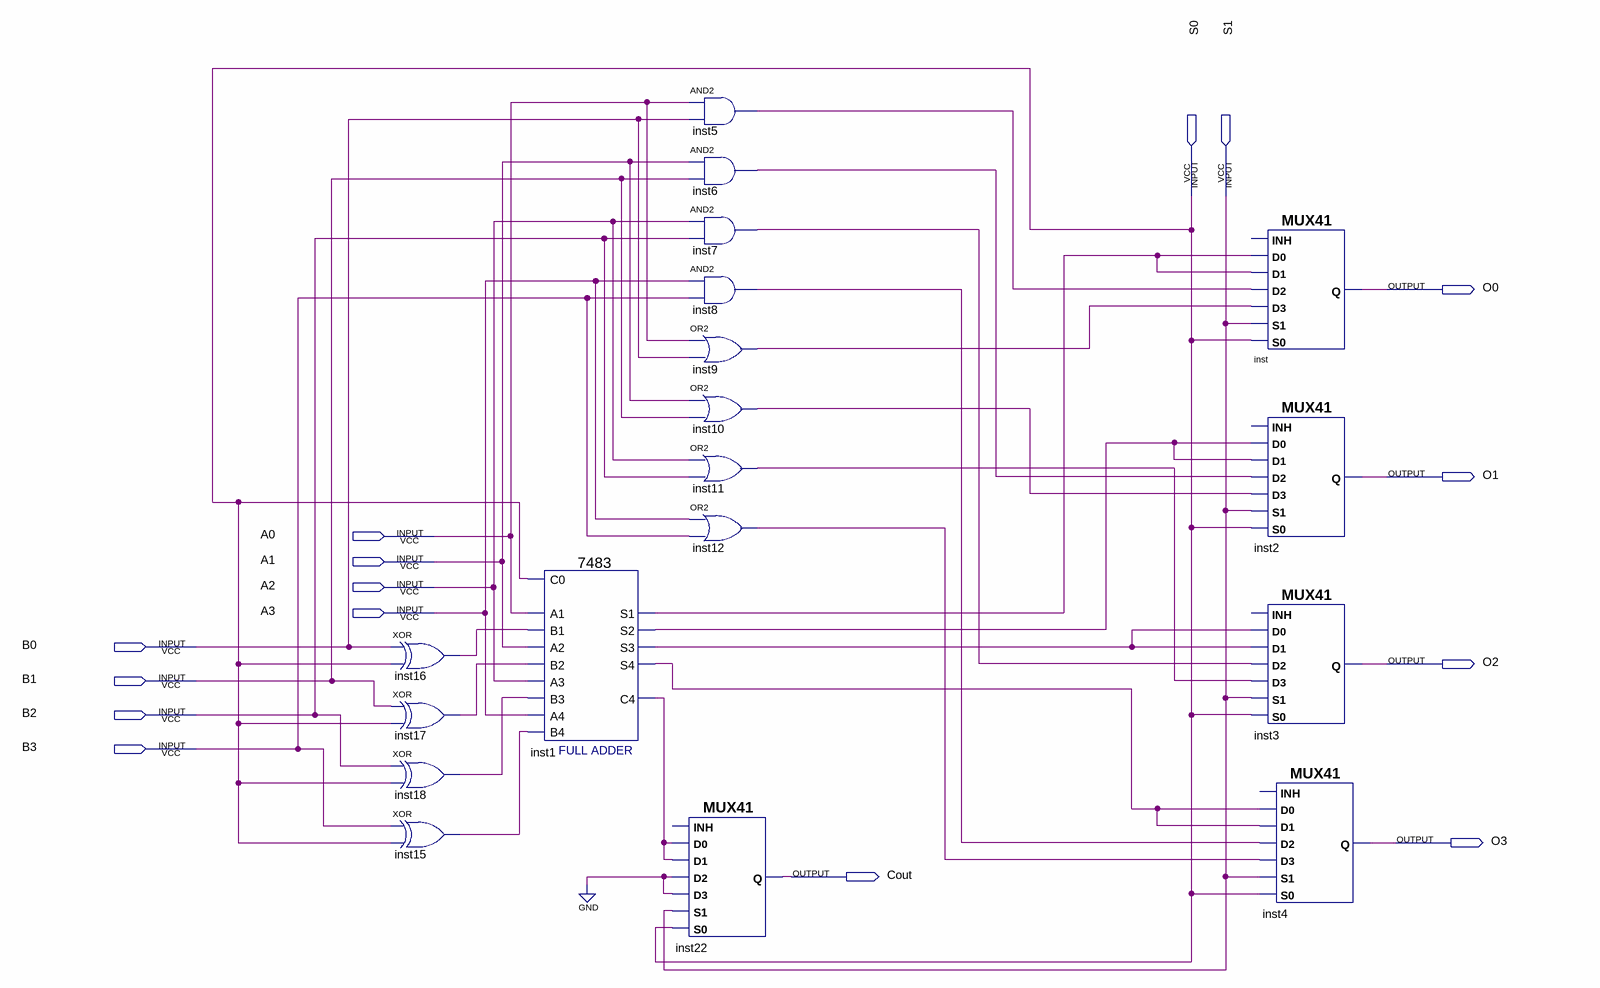
[diagram p0: schematic sheet]
// Quartus schematic lizur.bdf as structural Verilog: 18 symbols, 15 pins
module lizur (
  input  S0,
  input  S1,
  input  A0,
  input  A1,
  input  A2,
  input  A3,
  input  B0,
  input  B1,
  input  B2,
  input  B3,
  output O0,
  output O1,
  output O2,
  output O3,
  output Cout
);

  wire inst1_c4, inst1_s1, inst1_s2, inst1_s3, inst1_s4, inst5_out, inst6_out, inst7_out, inst8_out,
       inst9_out, inst10_out, inst11_out, inst12_out, inst15_out, inst16_out, inst17_out, inst18_out;

  xor inst16 (inst16_out, B0, S0);
  xor inst17 (inst17_out, B1, S0);
  xor inst18 (inst18_out, B2, S0);
  xor inst15 (inst15_out, B3, S0);
  \7483  inst1 (
    .B4(inst15_out), .C0(S0), .A1(A0), .A2(A1), .B1(inst16_out), .B2(inst17_out), .A3(A2), .B3(inst18_out),
    .A4(A3), .S3(inst1_s3), .S4(inst1_s4), .S2(inst1_s2), .C4(inst1_c4), .S1(inst1_s1));
  MUX41 inst22 (.S0(S0), .D2(1'b0), .S1(S1), .D3(1'b0), .D0(inst1_c4), .D1(inst1_c4), .Q(Cout));  // open: INH
  and inst5 (inst5_out, A0, B0);
  and inst6 (inst6_out, A1, B1);
  and inst7 (inst7_out, A2, B2);
  and inst8 (inst8_out, A3, B3);
  or inst9 (inst9_out, A0, B0);
  or inst10 (inst10_out, A1, B1);
  or inst11 (inst11_out, A2, B2);
  or inst12 (inst12_out, A3, B3);
  MUX41 inst (.S0(S0), .D2(inst5_out), .S1(S1), .D3(inst9_out), .D0(inst1_s1), .D1(inst1_s1), .Q(O0));  // open: INH
  MUX41 inst2 (.S0(S0), .D2(inst6_out), .S1(S1), .D3(inst10_out), .D0(inst1_s2), .D1(inst1_s2), .Q(O1));  // open: INH
  MUX41 inst3 (.S0(S0), .D2(inst7_out), .S1(S1), .D3(inst11_out), .D0(inst1_s3), .D1(inst1_s3), .Q(O2));  // open: INH
  MUX41 inst4 (.S0(S0), .D2(inst8_out), .S1(S1), .D3(inst12_out), .D0(inst1_s4), .D1(inst1_s4), .Q(O3));  // open: INH
endmodule
